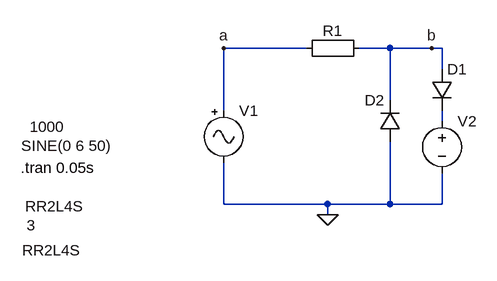
[diagram p0: schematic LD-REG-2.asc]
LD-REG-2.asc, the LTspice schematic file:
Version 4
SHEET 1 880 680
WIRE 16 96 -112 96
WIRE 144 96 96 96
WIRE 208 96 144 96
WIRE 224 96 208 96
WIRE 224 128 224 96
WIRE 144 176 144 96
WIRE -112 192 -112 96
WIRE 224 208 224 192
WIRE -112 336 -112 272
WIRE 48 336 -112 336
WIRE 144 336 144 240
WIRE 144 336 48 336
WIRE 224 336 224 288
WIRE 224 336 144 336
WIRE 48 352 48 336
FLAG -112 96 a
FLAG 208 96 b
FLAG 48 352 0
SYMBOL diode 208 128 R0
WINDOW 3 -625 211 Left 2
SYMATTR Value RR2L4S
SYMATTR InstName D1
SYMBOL Misc\\signal -112 176 R0
WINDOW 123 0 0 Left 2
WINDOW 39 0 0 Left 2
WINDOW 3 -311 70 Left 2
SYMATTR Value SINE(0 6 50)
SYMATTR InstName V1
SYMBOL Misc\\EuropeanResistor 112 80 R90
WINDOW 0 5 56 VBottom 2
WINDOW 3 121 495 VTop 2
SYMATTR InstName R1
SYMATTR Value 1000
SYMBOL voltage 224 192 R0
WINDOW 3 -639 176 Left 2
WINDOW 123 0 0 Left 2
WINDOW 39 0 0 Left 2
SYMATTR Value 3
SYMATTR InstName V2
SYMBOL diode 160 240 R180
WINDOW 3 491 -167 Left 2
WINDOW 0 24 64 Left 2
SYMATTR Value RR2L4S
SYMATTR InstName D2
TEXT -424 280 Left 2 !.tran 0.05s

The netlist it stands for:
* LD-REG-2.asc
D1 b N001 RR2L4S
V1 a 0 SINE(0 6 50)
R1 b a 1000
V2 N001 0 3
D2 0 b RR2L4S
.model D D
.lib standard.dio
.tran 0.05s
.backanno
.end